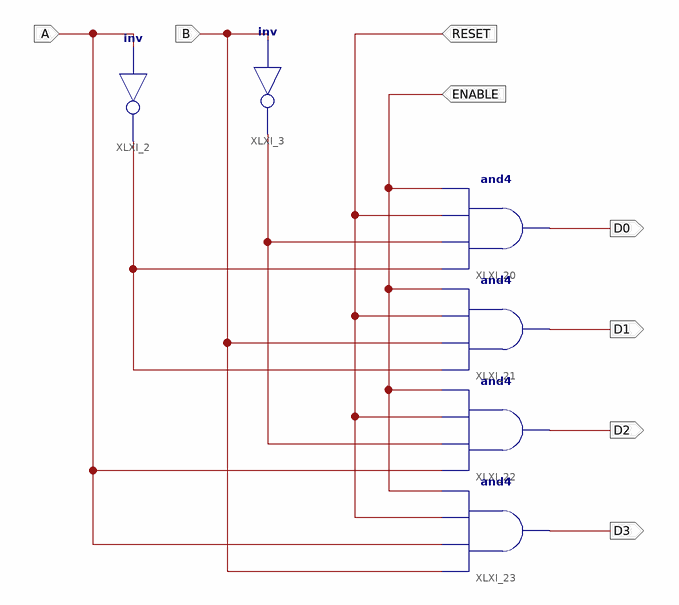
[diagram p0: schematic sheet 1]
// Xilinx ISE schematic Two_to_Four_Decoder.sch (spartan6) as structural Verilog: 6 symbols, 8 ports
module Two_to_Four_Decoder (
  input  RESET,
  input  A,
  input  B,
  input  ENABLE,
  output D3,
  output D2,
  output D1,
  output D0
);

  wire XLXN_58, XLXN_59;

  not XLXI_3 (XLXN_58, B);
  not XLXI_2 (XLXN_59, A);
  and XLXI_20 (D0, XLXN_59, XLXN_58, RESET, ENABLE);
  and XLXI_21 (D1, XLXN_59, B, RESET, ENABLE);
  and XLXI_22 (D2, A, XLXN_58, RESET, ENABLE);
  and XLXI_23 (D3, B, A, RESET, ENABLE);
endmodule
